# Altium schematic sheet Sheet1.SchDoc
size A3; SheetNumber: 1; SheetTotal: 1
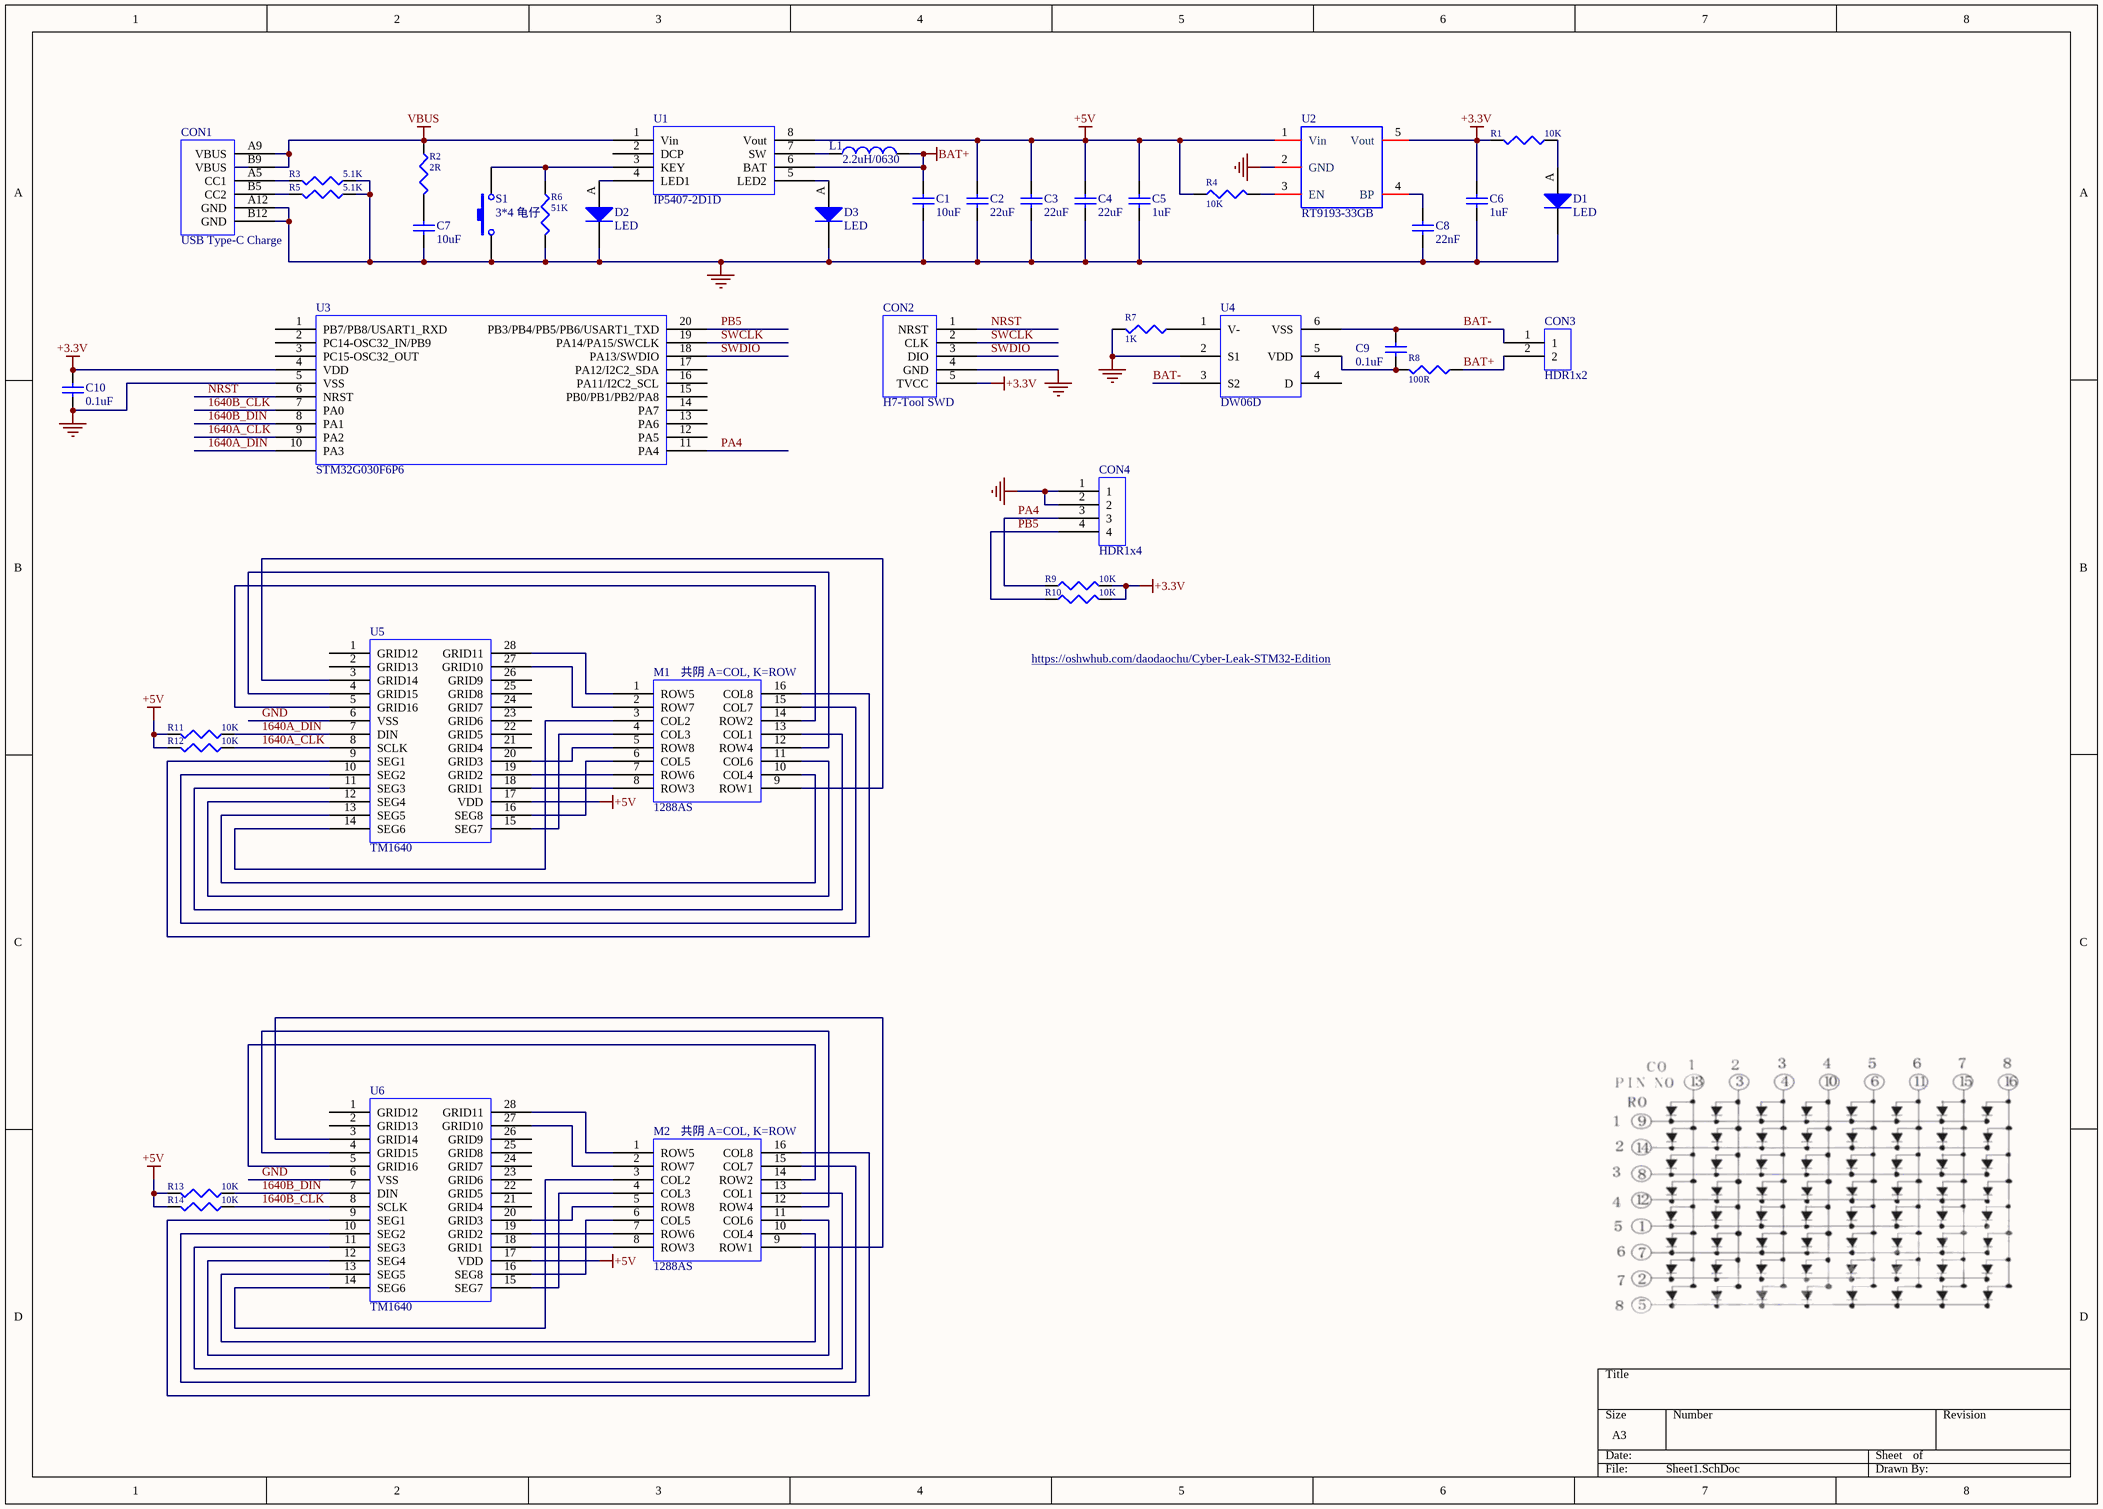
[diagram p0: Sheet1.SchDoc]

## Parts
C1  10uF  [0805_C]
C2  22uF  [0805_C]
C3  22uF  [0805_C]
C4  22uF  [0805_C]
C5  1uF  [0603_C]
C6  1uF  [0603_C]
C7  10uF  [0805_C]
C8  22nF  [0603_C]
C9  0.1uF  [0603_C]
C10  0.1uF  [0603_C]
CON1  USB Type-C Charge  [Type-C_6P立贴]
CON2  H7-Tool SWD  [hdr1x5]
CON3  HDR1x2  [HDR2.54-LI-2p]
CON4  HDR1x4  [RB-6635S-1T]
D1  LED  [0603_LED_S1]
D2  LED  [0603_LED_S1]
D3  LED  [0603_LED_S1]
L1  value 2.2uH/0630  [L-SMD-0630]  (hidden comment: Inductor)
M1  1288AS  [1288AS]
M2  1288AS  [1288AS]
R1  10K  [0603_R]
R2  2R  [0603_R]
R3  5.1K  [0603_R]
R4  10K  [0603_R]
R5  5.1K  [0603_R]
R6  51K  [0603_R]
R7  1K  [0603_R]
R8  100R  [0603_R]
R9  10K  [0603_R]
R10  10K  [0603_R]
R11  10K  [0603_R]
R12  10K  [0603_R]
R13  10K  [0603_R]
R14  10K  [0603_R]
S1  3*4 龟仔  [3x4小龟]
U1  IP5407-2D1D  [SOP-8_EP_150mil]
U2  RT9193-33GB  [SOT-23-5]
U3  STM32G030F6P6  [TSSOP-20]
U4  DW06D  [SOT-23-6]
U5  TM1640  [SOP-28_300mil]
U6  TM1640  [SOP-28_300mil]

## Nets
+3.3V: C6.2 C10.2 CON2.5(TVCC) R1.1(TOP) R9.1(TOP) R10.1(TOP) U2.5(Vout) U3.4(VDD)
+5V: C2.2 C3.2 C4.2 C5.2 R4.2(BOT) R11.1(TOP) R12.1(TOP) R13.1(TOP) R14.1(TOP) U1.8(Vout) U2.1(Vin) U5.17(VDD) U6.17(VDD)
BAT+: C1.2 CON3.2 L1.2 R8.2(BOT) U1.6(BAT)
GND: C1.1 C2.1 C3.1 C4.1 C5.1 C6.1 C7.1 C8.1 C10.1 CON1.A12(GND) CON1.B12(GND) CON2.4(GND) CON4.1 CON4.2 D1.K D2.K D3.K R3.2(BOT) R5.2(BOT) R6.1(TOP) R7.1(TOP) S1.1 U2.2(GND) U3.5(VSS) U4.2(S1) U5.6(VSS) U6.6(VSS)
VBUS: CON1.A9(VBUS) CON1.B9(VBUS) R2.2(BOT) U1.1(Vin)
1640A_CLK: R12.2(BOT) U3.9(PA2) U5.8(SCLK)
1640A_DIN: R11.2(BOT) U3.10(PA3) U5.7(DIN)
1640B_CLK: R14.2(BOT) U3.7(PA0) U6.8(SCLK)
1640B_DIN: R13.2(BOT) U3.8(PA1) U6.7(DIN)
BAT-: C9.2 CON3.1 U4.3(S2) U4.6(VSS)
NRST: CON2.1(NRST) U3.6(NRST)
PA4: CON4.3 R9.2(BOT) U3.11(PA4)
PB5: CON4.4 R10.2(BOT) U3.20(PB3/PB4/PB5/PB6/USART1_TXD)
SWCLK: CON2.2(CLK) U3.19(PA14/PA15/SWCLK)
SWDIO: CON2.3(DIO) U3.18(PA13/SWDIO)
NetC7_2: C7.2 R2.1(TOP)
NetC8_2: C8.2 U2.4(BP)
NetC9_1: C9.1 R8.1(TOP) U4.5(VDD)
NetCON1_A5: CON1.A5(CC1) R3.1(TOP)
NetCON1_B5: CON1.B5(CC2) R5.1(TOP)
NetD1_A: D1.A R1.2(BOT)
NetD2_A: D2.A U1.4(LED1)
NetD3_A: D3.A U1.5(LED2)
NetL1_1: L1.1 U1.7(SW)
NetM1_1: M1.1(ROW5) U5.28(GRID11)
NetM1_2: M1.2(ROW7) U5.27(GRID10)
NetM1_3: M1.3(COL2) U5.14(SEG6)
NetM1_4: M1.4(COL3) U5.15(SEG7)
NetM1_5: M1.5(ROW8) U5.20(GRID3)
NetM1_6: M1.6(COL5) U5.16(SEG8)
NetM1_7: M1.7(ROW6) U5.19(GRID2)
NetM1_8: M1.8(ROW3) U5.18(GRID1)
NetM1_9: M1.9(ROW1) U5.3(GRID14)
NetM1_10: M1.10(COL4) U5.13(SEG5)
NetM1_11: M1.11(COL6) U5.12(SEG4)
NetM1_12: M1.12(ROW4) U5.4(GRID15)
NetM1_13: M1.13(COL1) U5.11(SEG3)
NetM1_14: M1.14(ROW2) U5.5(GRID16)
NetM1_15: M1.15(COL7) U5.10(SEG2)
NetM1_16: M1.16(COL8) U5.9(SEG1)
NetM2_1: M2.1(ROW5) U6.28(GRID11)
NetM2_2: M2.2(ROW7) U6.27(GRID10)
NetM2_3: M2.3(COL2) U6.14(SEG6)
NetM2_4: M2.4(COL3) U6.15(SEG7)
NetM2_5: M2.5(ROW8) U6.20(GRID3)
NetM2_6: M2.6(COL5) U6.16(SEG8)
NetM2_7: M2.7(ROW6) U6.19(GRID2)
NetM2_8: M2.8(ROW3) U6.18(GRID1)
NetM2_9: M2.9(ROW1) U6.3(GRID14)
NetM2_10: M2.10(COL4) U6.13(SEG5)
NetM2_11: M2.11(COL6) U6.12(SEG4)
NetM2_12: M2.12(ROW4) U6.4(GRID15)
NetM2_13: M2.13(COL1) U6.11(SEG3)
NetM2_14: M2.14(ROW2) U6.5(GRID16)
NetM2_15: M2.15(COL7) U6.10(SEG2)
NetM2_16: M2.16(COL8) U6.9(SEG1)
NetR4_1: R4.1(TOP) U2.3(EN)
NetR6_2: R6.2(BOT) S1.2 U1.3(KEY)
NetR7_2: R7.2(BOT) U4.1(V-)

Not connected (* = marked no-connect by the designer): U1 2(DCP); U3 1(PB7/PB8/USART1_RXD) 2(PC14-OSC32_IN/PB9) 3(PC15-OSC32_OUT) 12(PA5) 13(PA6) 14(PA7) 15(PB0/PB1/PB2/PA8) 16(PA11/I2C2_SCL) 17(PA12/I2C2_SDA); U4 4(D); U5 1(GRID12) 2(GRID13) 21(GRID4) 22(GRID5) 23(GRID6) 24(GRID7) 25(GRID8) 26(GRID9); U6 1(GRID12) 2(GRID13) 21(GRID4) 22(GRID5) 23(GRID6) 24(GRID7) 25(GRID8) 26(GRID9)

## Notes on the sheet
- (near M1) 共阴 A=COL, K=ROW
- https://oshwhub.com/daodaochu/Cyber-Leak-STM32-Edition
- (near M2) 共阴 A=COL, K=ROW

## Library data of the parts
C1-C10 = 0603 100nF (104) 10% 50V: 贴片电容; ComponentLink1Description: 供应商链接; ComponentLink1URL: http://www.szlcsc.com/product/details_15331.html; Package: 0603; Supplier: LC; SuppliersPartNumber: C14663
D1-D3 = Diode: 二极管; Notepad: 1N4007 4007 编号C2464 已经停售, 使用新物料编号C95872; ComponentLink1Description: 供应商链接; ComponentLink1URL: http://www.szlcsc.com/product/details_2841.html; Package: SMA(DO-214AC); Supplier: LC; SuppliersPartNumber: C95872
L1 = Inductor: Code_IEC: 1005; Published: 8-Jun-2000; LatestRevisionDate: 29-May-2009; LatestRevisionNote: IPC-7351 Footprint Added.; PackageReference: 0402-A; Publisher: Altium Limited; PackageDescription: Chip Inductor; Code_JEITA: 0402
R1-R14 = RES: Resistor
S1 = SW-PB: Switch; Published: 24-Mar-1999; LatestRevisionDate: 17-Jul-2002; LatestRevisionNote: Re-released for DXP Platform.; PackageReference: SPST-2; Publisher: Altium Limited; PackageDescription: Switch; 2 Leads
U2 = RT9193-33GB: SOT23-5 300MA 3.3V LDO稳压器
U4 = DW06D: 二合一锂电池保护 IC
U5 U6 = TM1640: 具有显示模式(8 段×16 位),两线串行接口(SCLK，DIN)的LED驱动IC